# Altium schematic sheet PROB_S7CAS_ArbreAlimentation.SchDoc
size Tabloid; SheetNumber: 3; SheetTotal: 15; Sheet_Name: Arbre d'alimentation; Size: 11x17
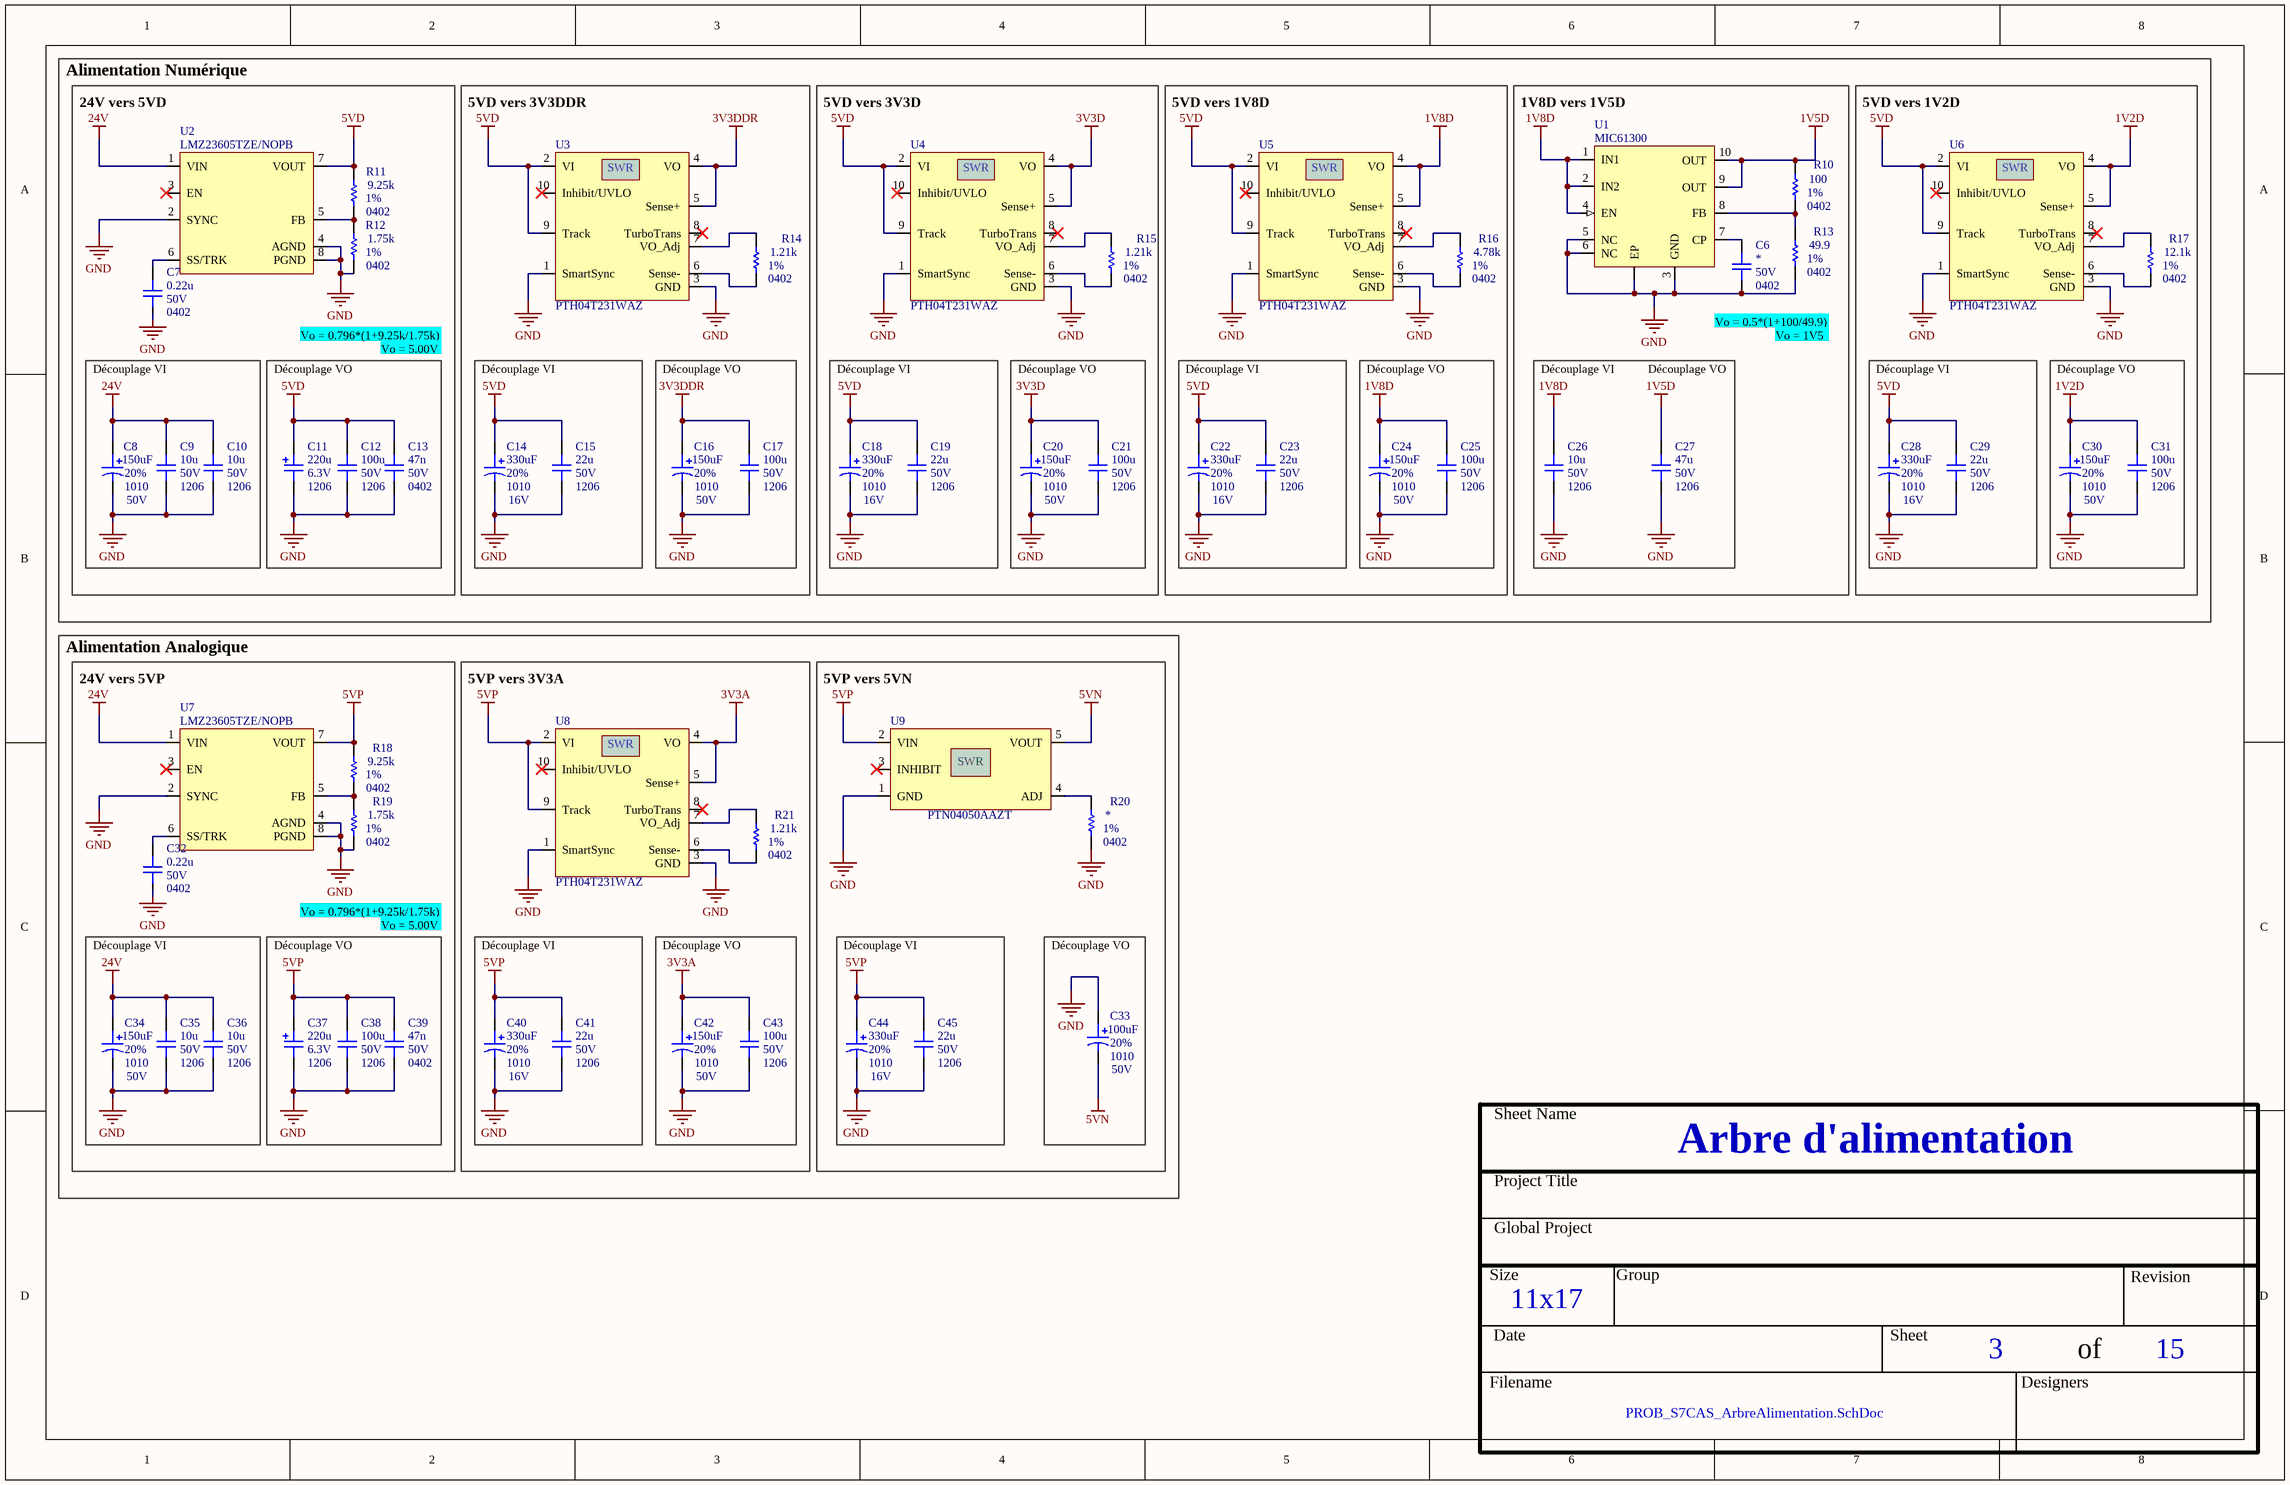
[diagram p0: PROB_S7CAS_ArbreAlimentation.SchDoc]

## Parts
C6  Voltage: 50V  Package: 0402  [CAP_0402]  (hidden comment: CAP - 0402)
C7  value 0.22u  Voltage: 50V  Package: 0402  [CAP_0402]  (hidden comment: CAP - 0402)
C8  value 150uF  Voltage: 50V  Package: 1010  Precision: 20%  [CAP_ALU_1010_vishay]  (hidden comment: MAL215099101E3)
C9  value 10u  Voltage: 50V  Package: 1206  [CAP_1206]  (hidden comment: CAP - 1206)
C10  value 10u  Voltage: 50V  Package: 1206  [CAP_1206]  (hidden comment: CAP - 1206)
C11  value 220u  Voltage: 6.3V  Package: 1206  [CAP_TAN_1206(A)]  (hidden comment: CAP - TANTALUM - CASE A)
C12  value 100u  Voltage: 50V  Package: 1206  [CAP_1206]  (hidden comment: CAP - 1206)
C13  value 47n  Voltage: 50V  Package: 0402  [CAP_0402]  (hidden comment: CAP - 0402)
C14  value 330uF  Voltage: 16V  Package: 1010  Precision: 20%  [CAP_ALU_1010_vishay]  (hidden comment: MAL214699501E3)
C15  value 22u  Voltage: 50V  Package: 1206  [CAP_1206]  (hidden comment: CAP - 1206)
C16  value 150uF  Voltage: 50V  Package: 1010  Precision: 20%  [CAP_ALU_1010_vishay]  (hidden comment: MAL215099101E3)
C17  value 100u  Voltage: 50V  Package: 1206  [CAP_1206]  (hidden comment: CAP - 1206)
C18  value 330uF  Voltage: 16V  Package: 1010  Precision: 20%  [CAP_ALU_1010_vishay]  (hidden comment: MAL214699501E3)
C19  value 22u  Voltage: 50V  Package: 1206  [CAP_1206]  (hidden comment: CAP - 1206)
C20  value 150uF  Voltage: 50V  Package: 1010  Precision: 20%  [CAP_ALU_1010_vishay]  (hidden comment: MAL215099101E3)
C21  value 100u  Voltage: 50V  Package: 1206  [CAP_1206]  (hidden comment: CAP - 1206)
C22  value 330uF  Voltage: 16V  Package: 1010  Precision: 20%  [CAP_ALU_1010_vishay]  (hidden comment: MAL214699501E3)
C23  value 22u  Voltage: 50V  Package: 1206  [CAP_1206]  (hidden comment: CAP - 1206)
C24  value 150uF  Voltage: 50V  Package: 1010  Precision: 20%  [CAP_ALU_1010_vishay]  (hidden comment: MAL215099101E3)
C25  value 100u  Voltage: 50V  Package: 1206  [CAP_1206]  (hidden comment: CAP - 1206)
C26  value 10u  Voltage: 50V  Package: 1206  [CAP_1206]  (hidden comment: CAP - 1206)
C27  value 47u  Voltage: 50V  Package: 1206  [CAP_1206]  (hidden comment: CAP - 1206)
C28  value 330uF  Voltage: 16V  Package: 1010  Precision: 20%  [CAP_ALU_1010_vishay]  (hidden comment: MAL214699501E3)
C29  value 22u  Voltage: 50V  Package: 1206  [CAP_1206]  (hidden comment: CAP - 1206)
C30  value 150uF  Voltage: 50V  Package: 1010  Precision: 20%  [CAP_ALU_1010_vishay]  (hidden comment: MAL215099101E3)
C31  value 100u  Voltage: 50V  Package: 1206  [CAP_1206]  (hidden comment: CAP - 1206)
C32  value 0.22u  Voltage: 50V  Package: 0402  [CAP_0402]  (hidden comment: CAP - 0402)
C33  value 100uF  Voltage: 50V  Package: 1010  Precision: 20%  [CAP_ALU_1010_vishay]  (hidden comment: MAL215099101E3)
C34  value 150uF  Voltage: 50V  Package: 1010  Precision: 20%  [CAP_ALU_1010_vishay]  (hidden comment: MAL215099101E3)
C35  value 10u  Voltage: 50V  Package: 1206  [CAP_1206]  (hidden comment: CAP - 1206)
C36  value 10u  Voltage: 50V  Package: 1206  [CAP_1206]  (hidden comment: CAP - 1206)
C37  value 220u  Voltage: 6.3V  Package: 1206  [CAP_TAN_1206(A)]  (hidden comment: CAP - TANTALUM - CASE A)
C38  value 100u  Voltage: 50V  Package: 1206  [CAP_1206]  (hidden comment: CAP - 1206)
C39  value 47n  Voltage: 50V  Package: 0402  [CAP_0402]  (hidden comment: CAP - 0402)
C40  value 330uF  Voltage: 16V  Package: 1010  Precision: 20%  [CAP_ALU_1010_vishay]  (hidden comment: MAL214699501E3)
C41  value 22u  Voltage: 50V  Package: 1206  [CAP_1206]  (hidden comment: CAP - 1206)
C42  value 150uF  Voltage: 50V  Package: 1010  Precision: 20%  [CAP_ALU_1010_vishay]  (hidden comment: MAL215099101E3)
C43  value 100u  Voltage: 50V  Package: 1206  [CAP_1206]  (hidden comment: CAP - 1206)
C44  value 330uF  Voltage: 16V  Package: 1010  Precision: 20%  [CAP_ALU_1010_vishay]  (hidden comment: MAL214699501E3)
C45  value 22u  Voltage: 50V  Package: 1206  [CAP_1206]  (hidden comment: CAP - 1206)
R10  value 100  Package: 0402  Precision: 1%  [RES_0402]  (hidden comment: RES - 0402)
R11  value 9.25k  Package: 0402  Precision: 1%  [RES_0402]  (hidden comment: RES - 0402)
R12  value 1.75k  Package: 0402  Precision: 1%  [RES_0402]  (hidden comment: RES - 0402)
R13  value 49.9  Package: 0402  Precision: 1%  [RES_0402]  (hidden comment: RES - 0402)
R14  value 1.21k  Package: 0402  Precision: 1%  [RES_0402]  (hidden comment: RES - 0402)
R15  value 1.21k  Package: 0402  Precision: 1%  [RES_0402]  (hidden comment: RES - 0402)
R16  value 4.78k  Package: 0402  Precision: 1%  [RES_0402]  (hidden comment: RES - 0402)
R17  value 12.1k  Package: 0402  Precision: 1%  [RES_0402]  (hidden comment: RES - 0402)
R18  value 9.25k  Package: 0402  Precision: 1%  [RES_0402]  (hidden comment: RES - 0402)
R19  value 1.75k  Package: 0402  Precision: 1%  [RES_0402]  (hidden comment: RES - 0402)
R20  Package: 0402  Precision: 1%  [RES_0402]  (hidden comment: RES - 0402)
R21  value 1.21k  Package: 0402  Precision: 1%  [RES_0402]  (hidden comment: RES - 0402)
U1  MIC61300  [TSSOP50P490X104-10N]
U2  LMZ23605TZE/NOPB  [REG_SWR_LMZ23605TZE/NOPB]
U3  PTH04T231WAZ  [REG_SWR_PTH04T231WAZ]
U4  PTH04T231WAZ  [REG_SWR_PTH04T231WAZ]
U5  PTH04T231WAZ  [REG_SWR_PTH04T231WAZ]
U6  PTH04T231WAZ  [REG_SWR_PTH04T231WAZ]
U7  LMZ23605TZE/NOPB  [REG_SWR_LMZ23605TZE/NOPB]
U8  PTH04T231WAZ  [REG_SWR_PTH04T231WAZ]
U9  PTN04050AAZT  [REG_SWR_PTN04050AAZT]

## Nets
1V2D: C30.1 C31.2 U6.4(VO) U6.5(Sense+)
1V5D: C27.2 R10.2 U1.9(OUT) U1.10(OUT)
1V8D: C24.1 C25.2 C26.2 U1.1(IN1) U1.2(IN2) U1.4(EN) U5.4(VO) U5.5(Sense+)
3V3A: C42.1 C43.2 U8.4(VO) U8.5(Sense+)
3V3D: C20.1 C21.2 U4.4(VO) U4.5(Sense+)
3V3DDR: C16.1 C17.2 U3.4(VO) U3.5(Sense+)
5VD: C11.2 C12.2 C13.2 C14.1 C15.2 C18.1 C19.2 C22.1 C23.2 C28.1 C29.2 R11.2 U2.7(VOUT) U3.2(VI) U3.9(Track) U4.2(VI) U4.9(Track) U5.2(VI) U5.9(Track) U6.2(VI) U6.9(Track)
5VN: C33.2 U9.5(VOUT)
5VP: C37.2 C38.2 C39.2 C40.1 C41.2 C44.1 C45.2 R18.2 U7.7(VOUT) U8.2(VI) U8.9(Track) U9.2(VIN)
24V: C8.1 C9.2 C10.2 C34.1 C35.2 C36.2 U2.1(VIN) U7.1(VIN)
GND: C6.1 C7.1 C8.2 C9.1 C10.1 C11.1 C12.1 C13.1 C14.2 C15.1 C16.2 C17.1 C18.2 C19.1 C20.2 C21.1 C22.2 C23.1 C24.2 C25.1 C26.1 C27.1 C28.2 C29.1 C30.2 C31.1 C32.1 C33.1 C34.2 C35.1 C36.1 C37.1 C38.1 C39.1 C40.2 C41.1 C42.2 C43.1 C44.2 C45.1 R12.1 R13.1 R19.1 R20.1 U1.3(GND) U1.5(NC) U1.6(NC) U1.?1(EP) U2.2(SYNC) U2.4(AGND) U2.8(PGND) U3.1(SmartSync) U3.3(GND) U4.1(SmartSync) U4.3(GND) U5.1(SmartSync) U5.3(GND) U6.1(SmartSync) U6.3(GND) U7.2(SYNC) U7.4(AGND) U7.8(PGND) U8.1(SmartSync) U8.3(GND) U9.1(GND)
NetC6_2: C6.2 U1.7(CP)
NetC7_2: C7.2 U2.6(SS/TRK)
NetC32_2: C32.2 U7.6(SS/TRK)
NetR10_1: R10.1 R13.2 U1.8(FB)
NetR11_1: R11.1 R12.2 U2.5(FB)
NetR14_1: R14.1 U3.6(Sense-)
NetR14_2: R14.2 U3.7(VO_Adj)
NetR15_1: R15.1 U4.6(Sense-)
NetR15_2: R15.2 U4.7(VO_Adj)
NetR16_1: R16.1 U5.6(Sense-)
NetR16_2: R16.2 U5.7(VO_Adj)
NetR17_1: R17.1 U6.6(Sense-)
NetR17_2: R17.2 U6.7(VO_Adj)
NetR18_1: R18.1 R19.2 U7.5(FB)
NetR20_2: R20.2 U9.4(ADJ)
NetR21_1: R21.1 U8.6(Sense-)
NetR21_2: R21.2 U8.7(VO_Adj)

Not connected (* = marked no-connect by the designer): U2 3(EN)*; U3 8(TurboTrans)* 10(Inhibit/UVLO)*; U4 8(TurboTrans)* 10(Inhibit/UVLO)*; U5 8(TurboTrans)* 10(Inhibit/UVLO)*; U6 8(TurboTrans)* 10(Inhibit/UVLO)*; U7 3(EN)*; U8 8(TurboTrans)* 10(Inhibit/UVLO)*; U9 3(INHIBIT)*

## Notes on the sheet
- Alimentation Numérique
- (near U2) 24V vers 5VD
- (near U3) 5VD vers 3V3DDR
- (near U4) 5VD vers 3V3D
- (near U5) 5VD vers 1V8D
- (near U1) 1V8D vers 1V5D
- (near U6) 5VD vers 1V2D
- Vo = 0.796*(1+9.25k/1.75k)
- Vo = 5.00V
- Vo = 0.5*(1+100/49.9)
- Vo = 1V5
- Découplage VI
- Découplage VO
- Alimentation Analogique
- (near U7) 24V vers 5VP
- (near U8) 5VP vers 3V3A
- (near U9) 5VP vers 5VN
- Sheet Name
- Project Title
- Global Project
- Size
- Group
- Revision
- Date
- Sheet
- of
- Filename
- Designers
- (in symbol REG_SWR_PTH04T231WAZ) SWR
- (in symbol REG_SWR_PTN04050AAZT) SWR

## Library data of the parts
C6 C7 C13 C32 C39 = CAP - 0402: Precision: 10%; Current: *; CreatedBy: Jonathan Bouchard; Power: *
  C6: Value: *
C8 C16 C20 C24 C30 C33 C34 C42 = CAP_ALU_MAL215099101E3: CAP - ALU 100uF 20% 50V - 1010; Current: 490mA; Mfg: Vishay Dale; Mfg Part Number: MAL215099101E3; HelpURL: http://www.vishay.com/docs/28395/150crz.pdf; CreatedBy: Jonathan Bouchard; Temperature: -55°C to 125°C; Power: *; Supplier 1: Digikey; Supplier Part Number 1: 4399PHDKR-ND
C9 C10 C12 C15 C17 C19 C21 C23 C25-C27 C29 C31 C35 C36 C38 C41 C43 C45 = CAP - 1206: Precision: 10%; Current: *; CreatedBy: Jonathan Bouchard; Power: *
C11 C37 = CAP_TANT_1206(A): CAP - TANTALUM - 1206; Precision: 10%; Current: *; CreatedBy: Jonathan Bouchard; Power: *
C14 C18 C22 C28 C40 C44 = CAP_ALU_MAL214699501E3: CAP - ALU 330uF 20% 16V - 1010; Current: 750mA; Mfg: Vishay Dale; Mfg Part Number: MAL214699501E3; HelpURL: http://www.vishay.com/docs/28403/146cti.pdf; CreatedBy: Jonathan Bouchard; Temperature: -55°C to 125°C; Power: *; Supplier 1: Digikey; Supplier Part Number 1: 4405PHCT-ND
R10-R21 = RES - 0402: Voltage: 50V; Power: 1/16W; Current: *; CreatedBy: Jonathan Bouchard
  R20: Value: *
U1 = MIC61300: MIC61300 - Low Input Voltage, Single-Supply / High-Current LDO - MSOP; GRAMS Lib Spec: 2.7; HelpURL: https://ww1.microchip.com/downloads/en/DeviceDoc/mic61300.pdf
U2 U7 = REG_SWR_LMZ23605TZE/NOPB: REG - IC BUCK SYNC 36V 5A - TO-PMOD-7; Manufacturer #1: Texas Instruments; Value: 0.8 ~ 6 V; Voltage Rating: 6 ~ 36 V; GRAMS Lib Spec: 2.8; Note: One Reflow; Magnetic Material: YES; Cryo: UNKNOWN; Tolerance: *; Current Rating: 5A; Power Max: *; HelpURL: http://www.ti.com/lit/ds/symlink/lmz23605.pdf; CreatedBy/Date: Arnaud Samson - 05/07/18; VerifiedBy: Jonathan Bouchard 2018-07-13; Temperature: -40°C ~ 125°C; Package: TO-PMOD-7; Manufacturer #2: *; Assembly Type: SMD; Part Number #2: *; Part Number #1: LMZ23605TZE/NOPB; Polarized: YES; Supplier 1: Digi-Key; Supplier Part Number 1: 296-35357-1-ND
U3-U6 U8 = REG_SWR_PTH04T231WAZ: REG - MODULE PIP 6A 2.2V/5.5V - 10SMD; Manufacturer #1: Texas Instruments; Current Rating: 6A (out); Value: 0.69 - 3.6V (Out); Voltage rating: 2.2-5.5V (Input); Polarized: Yes; Magnetic Material: UNKNOWN; Manufacturer #2: *; Note: *; Power Max: *; Part Number #1: PTH04T231WAZ; Part Number #2: *; HelpURL: http://www.ti.com/lit/ds/symlink/pth04t231w.pdf; Supplier 1: Digi-Key; Assembly Type: SMD; Temperature: -40°C ~ 85°C; Supplier Part Number 1: 296-21792-ND; Package: SMD; CreatedBy/Date: Olivier Bernard / 6/5/2018; VerifiedBy: Caroline Paulin / 10 juillet 2018; Cryo: UNKNOWN
U9 = REG_SWR_PTN04050AAZT: REG - SWR -15 ~ -3.3V 1A 6W - 5-SMD; Manufacturer #1: Texas Instruments; Voltage Rating: 2.9V~7Vin; GRAMS Lib Spec: 2.8; Magnetic Material: Unknown; Polarized: Yes; Value: -15 ~ -3.3V; Tolerance: *; Current Rating: 1A; Power Max: 6W; HelpURL: http://www.ti.com/lit/ds/symlink/ptn04050a.pdf; CreatedBy/Date: Ihsane Najahi 2019-09-25; VerifiedBy: C.Paulin (9-10-2019); Temperature: -40°C ~ 85°C; Package: 5-SMD; Manufacturer #2: *; Note: *; Assembly Type: 5-SMD; Part Number #2: *; Part Number #1: PTN04050AAZT; Supplier 1: Digi-Key; Supplier Part Number 1: 296-32208-1-ND; Cryo: UNKNOWN